# Altium schematic sheet DC_link_2L.SchDoc
size A4
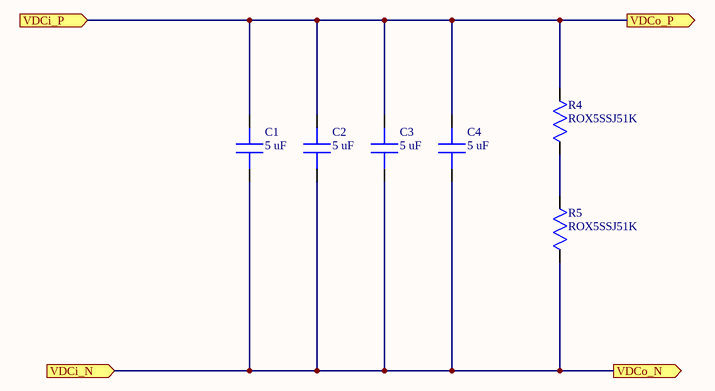
[diagram p0: DC_link_2L.SchDoc]

## Parts
C1  Capacitance: 5 uF  [MKP1848S55010JP4B]  (hidden comment: MKP1848S55010JP4B)
C2  Capacitance: 5 uF  [MKP1848S55010JP4B]  (hidden comment: MKP1848S55010JP4B)
C3  Capacitance: 5 uF  [MKP1848S55010JP4B]  (hidden comment: MKP1848S55010JP4B)
C4  Capacitance: 5 uF  [MKP1848S55010JP4B]  (hidden comment: MKP1848S55010JP4B)
R4  ROX5SSJ51K  [RES_ROX5SS]
R5  ROX5SSJ51K  [RES_ROX5SS]

## Ports
VDCi_N (in), VDCi_P (in), VDCo_N (out), VDCo_P (out)

## Nets
VDCi_N: C1.2 C2.2 C3.2 C4.2 R5.1 ; port VDCo_N, port VDCi_N
VDCi_P: C1.1 C2.1 C3.1 C4.1 R4.2 ; port VDCo_P, port VDCi_P
NetR4_1: R4.1 R5.2

## Library data of the parts
C1-C4 = MKP1848S55010JP4B: Film Capacitors 5uF 5% 1000volts 4pins 37.5mm LS; Manufacturer: Vishay; Voltage Rating DC: 1000 V; ESR: 11.5 mOhm; Tolerance: 5 %; Number of Pins: 4; Supplier 1: Mouser; Supplier Part Number 1: 75-MKP1848S55010JP4B
R4 R5 = ROX5SSJ51K: Metal Oxide Resistors 5W XSM M/OX 5% 51K; Manufacturer: TE Connectivity; Value: 51 kOhm; Manufacturer Part Number: ROX5SSJ51K; RoHS: No; Stock 1: 846; Pricing 1: 1=0,66000, 10=0,54900, 25=0,47080, 50=0,42360, 100=0,36880, 250=0,32952 (USD); Power: 5 W; Tolerance: 5 %; Length: 17.5 mm; Diameter: 6.5 mm; Supplier 1: Digi-Key; Supplier 2: Digi-Key; Supplier 3: RSComponents; Supplier 4: Mouser; Supplier 5: Farnell; Supplier Part Number 5: 3229952; Supplier Part Number 4: 279-ROX5SSJ51K; Supplier Part Number 3: 1869581; Supplier Part Number 2: A142841TB-ND; Supplier Part Number 1: A142841CT-ND